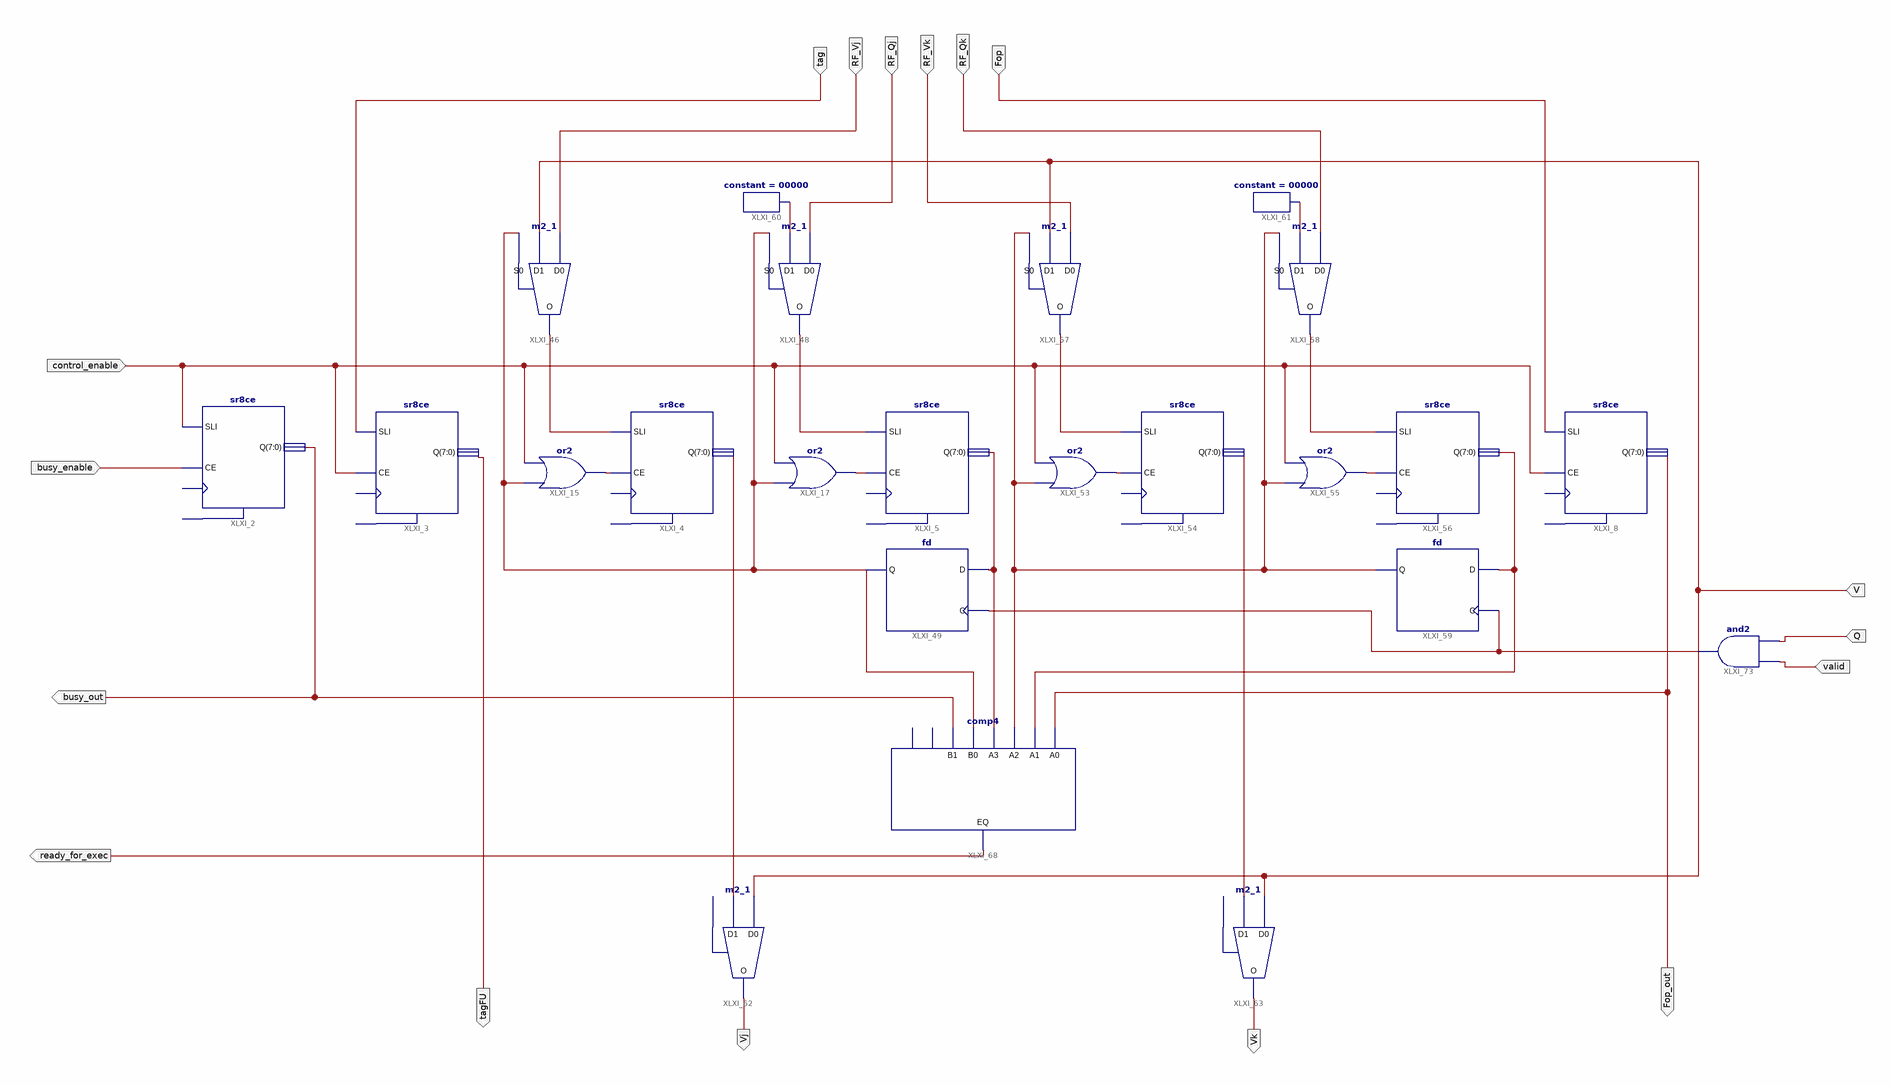
[diagram p0: schematic sheet 1]
// Xilinx ISE schematic rs_line.sch (spartan3e) as structural Verilog: 23 symbols, 17 ports
module rs_line (
  input  busy_enable,
  input  control_enable,
  input  Fop,
  input  tag,
  input  V,
  input  RF_Vj,
  input  RF_Qj,
  input  RF_Vk,
  input  RF_Qk,
  input  Q,
  input  valid,
  output busy_out,
  output tagFU,
  output Fop_out,
  output ready_for_exec,
  output Vk,
  output Vj
);

  wire cdb_Q, XLXN_15, XLXN_16, XLXN_37, XLXN_46, XLXN_92, XLXN_99, XLXN_101, XLXN_108, XLXN_109, XLXN_110,
       XLXN_111, XLXN_113, XLXN_118, XLXN_129, XLXN_138, zero;

  sr8ce XLXI_2 (.CE(busy_enable), .SLI(control_enable), .Q(busy_out));  // open: C, CLR
  sr8ce XLXI_8 (.CE(control_enable), .SLI(Fop), .Q(Fop_out));  // open: C, CLR
  sr8ce XLXI_3 (.CE(control_enable), .SLI(tag), .Q(tagFU));  // open: C, CLR
  sr8ce XLXI_4 (.CE(XLXN_37), .SLI(XLXN_16), .Q(XLXN_101));  // open: C, CLR
  or XLXI_15 (XLXN_37, XLXN_92, control_enable);
  or XLXI_17 (XLXN_46, XLXN_92, control_enable);
  sr8ce XLXI_5 (.CE(XLXN_46), .SLI(XLXN_15), .Q(XLXN_99));  // open: C, CLR
  m2_1 XLXI_46 (.D0(RF_Vj), .D1(V), .S0(XLXN_92), .O(XLXN_16));
  m2_1 XLXI_48 (.D0(RF_Qj), .D1(zero), .S0(XLXN_92), .O(XLXN_15));
  fd XLXI_49 (.C(cdb_Q), .D(XLXN_99), .Q(XLXN_92));
  or XLXI_53 (XLXN_108, XLXN_113, control_enable);
  sr8ce XLXI_54 (.CE(XLXN_108), .SLI(XLXN_111), .Q(XLXN_138));  // open: C, CLR
  or XLXI_55 (XLXN_109, XLXN_113, control_enable);
  sr8ce XLXI_56 (.CE(XLXN_109), .SLI(XLXN_110), .Q(XLXN_118));  // open: C, CLR
  m2_1 XLXI_57 (.D0(RF_Vk), .D1(V), .S0(XLXN_113), .O(XLXN_111));
  m2_1 XLXI_58 (.D0(RF_Qk), .D1(XLXN_129), .S0(XLXN_113), .O(XLXN_110));
  fd XLXI_59 (.C(cdb_Q), .D(XLXN_118), .Q(XLXN_113));
  constant #(.CValue("00000")) XLXI_60 (.O(zero));
  constant #(.CValue("00000")) XLXI_61 (.O(XLXN_129));
  m2_1 XLXI_62 (.D0(V), .D1(XLXN_101), .O(Vj));  // open: S0
  m2_1 XLXI_63 (.D0(V), .D1(XLXN_138), .O(Vk));  // open: S0
  comp4 XLXI_68 (
    .A0(Fop_out), .A1(XLXN_118), .A2(XLXN_113), .A3(XLXN_99), .B0(XLXN_92), .B1(busy_out), .EQ(ready_for_exec));  // open: B2, B3
  and XLXI_73 (cdb_Q, valid, Q);
endmodule
